# Altium schematic sheet Mounting_Holes.SchDoc
size A4; SheetNumber: 5; SheetTotal: 6
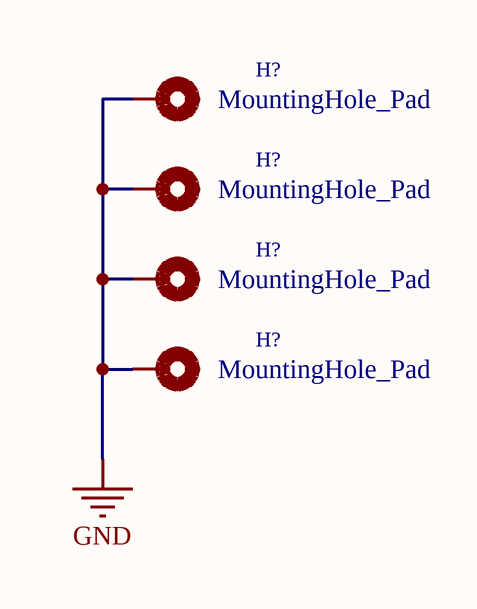
[diagram p0: Mounting_Holes.SchDoc]

## Parts
(Parts that share a designator on the sheet are numbered #1, #2 ... from top to bottom, then left to right.)
H?#1  MountingHole_Pad  [MountingHole_4.3mm_M4_Pad_Via]
H?#2  MountingHole_Pad  [MountingHole_4.3mm_M4_Pad_Via]
H?#3  MountingHole_Pad  [MountingHole_4.3mm_M4_Pad_Via]
H?#4  MountingHole_Pad  [MountingHole_4.3mm_M4_Pad_Via]

## Nets
GND: H?#1.1 H?#2.1 H?#3.1 H?#4.1

## Library data of the parts
H?#1-H?#4 = MountingHole_Pad: Value: MountingHole_Pad; Footprint: MountingHole:MountingHole_4.3mm_M4_Pad_Via